# Altium project uz_per_current_measurement_hc5fw.PrjPcb
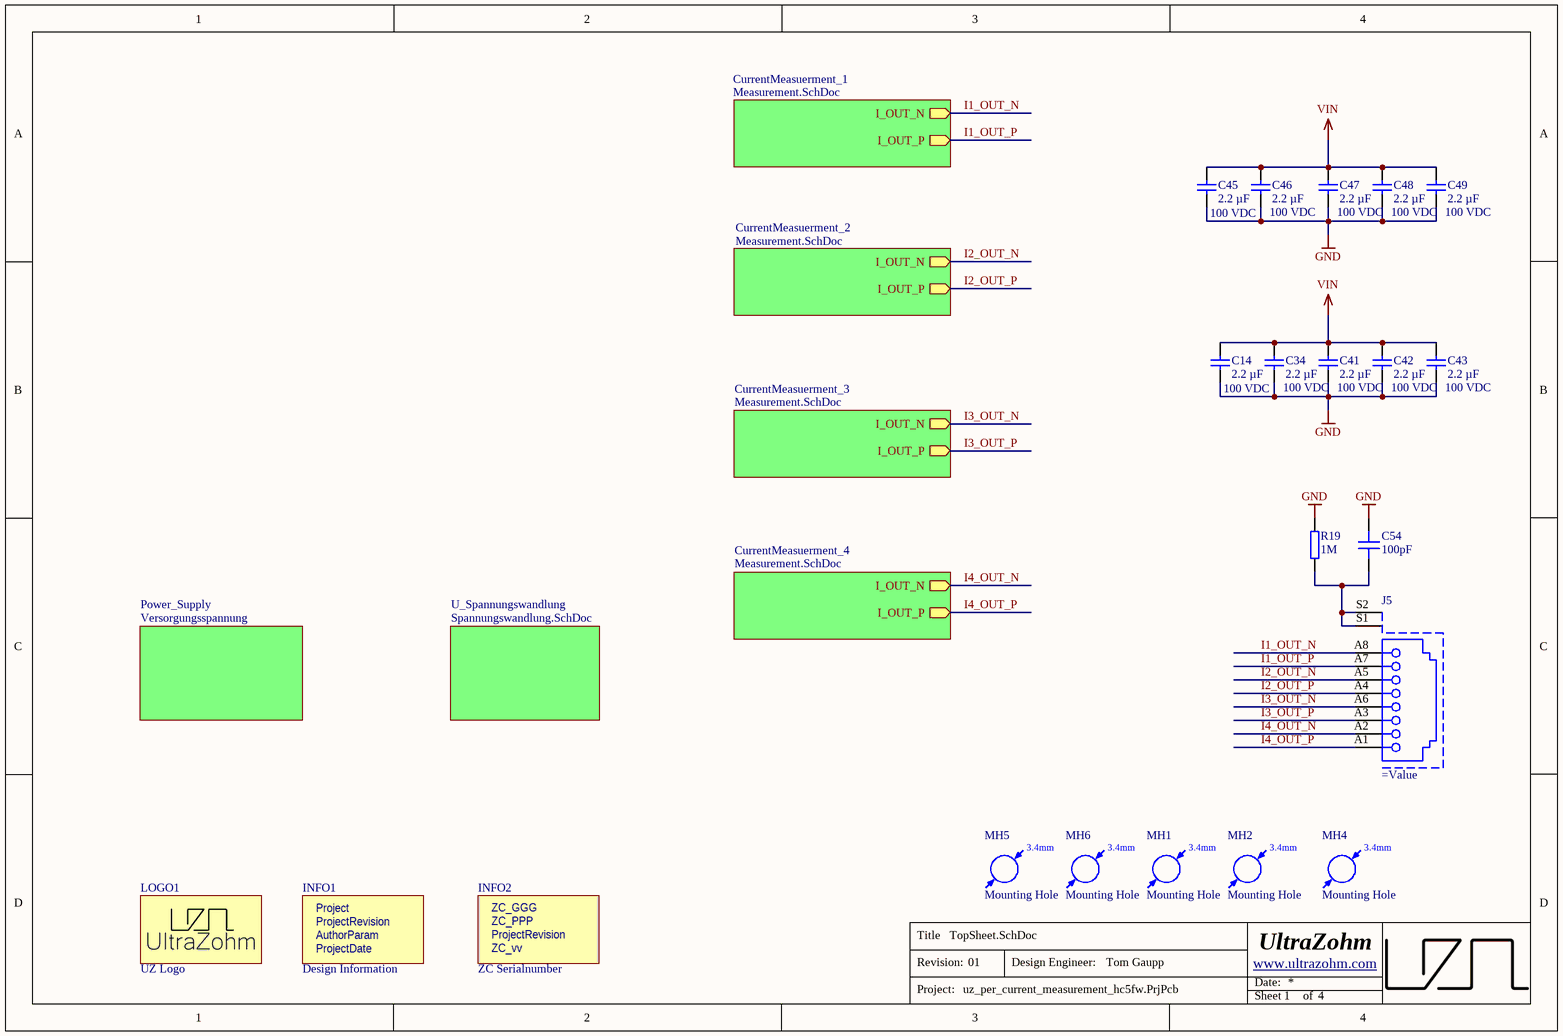
[diagram p0: TopSheet.SchDoc]
AuthorParam: Tom Gaupp; Project: uz_per_current_measurement_hc5fw; ProjectDate: 08/26; ProjectRevision: 01; ZC_GGG: 004; ZC_PPP: 008; ZC_vv: 0400
4 sheets, 210 parts. Net scope: hierarchical (ports join the sheet entries above them; power ports are global).
Board file: Strommessplatine.PcbDoc
Sheets:
  TopSheet.SchDoc
    CurrentMeasuerment_1 = Measurement.SchDoc
    CurrentMeasuerment_2 = Measurement.SchDoc
    U_Spannungswandlung = Spannungswandlung.SchDoc
    CurrentMeasuerment_3 = Measurement.SchDoc
    CurrentMeasuerment_4 = Measurement.SchDoc
    Power_Supply = Versorgungsspannung.SchDoc

## Sheet TopSheet.SchDoc
size A4; Author: Tom Gaupp; CompanyName: Technische Hochschule Nürnberg Georg Simon Ohm; Organization: UltraZohm; Address1: Kesslerplatz 12; Address2: 90489 Nürnberg; Address3: GERMANY; DocumentNumber: 2; SheetNumber: 1; SheetTotal: 4; Website: www.ultrazohm.com

### Parts
C14  2.2 µF  Voltage Rating: 100 VDC  [C_1210_TE]
C34  2.2 µF  Voltage Rating: 100 VDC  [C_1210_TE]
C41  2.2 µF  Voltage Rating: 100 VDC  [C_1210_TE]
C42  2.2 µF  Voltage Rating: 100 VDC  [C_1210_TE]
C43  2.2 µF  Voltage Rating: 100 VDC  [C_1210_TE]
C45  2.2 µF  Voltage Rating: 100 VDC  [C_1210_TE]
C46  2.2 µF  Voltage Rating: 100 VDC  [C_1210_TE]
C47  2.2 µF  Voltage Rating: 100 VDC  [C_1210_TE]
C48  2.2 µF  Voltage Rating: 100 VDC  [C_1210_TE]
C49  2.2 µF  Voltage Rating: 100 VDC  [C_1210_TE]
C54  100pF  [C_1206_TE]
INFO1  Design Information  [Design_info]  (no BOM)
INFO2  ZC Serialnumber  [ZC-Serial]  (no BOM)
J5  (no value)  [R-RJ45R10P-B000]
LOGO1  UZ Logo  [UZ_Logo_small]  (no BOM)
MH1  Mounting Hole  [MH_3.4]  (no BOM)
MH2  Mounting Hole  [MH_3.4]  (no BOM)
MH4  Mounting Hole  [MH_3.4]  (no BOM)
MH5  Mounting Hole  [MH_3.4]  (no BOM)
MH6  Mounting Hole  [MH_3.4]  (no BOM)
R19  1M  [RES 0603_1608]

### Sub-sheets
CurrentMeasuerment_1 = Measurement.SchDoc: I_OUT_P (out), I_OUT_N (out)
CurrentMeasuerment_2 = Measurement.SchDoc: I_OUT_P (out), I_OUT_N (out)
CurrentMeasuerment_3 = Measurement.SchDoc: I_OUT_P (out), I_OUT_N (out)
CurrentMeasuerment_4 = Measurement.SchDoc: I_OUT_P (out), I_OUT_N (out)
Power_Supply = Versorgungsspannung: no entries
U_Spannungswandlung = Spannungswandlung.SchDoc: no entries

### Nets
GND: C14.2 C34.2 C41.2 C42.2 C43.2 C45.2 C46.2 C47.2 C48.2 C49.2 C54.2 R19.2
VIN: C14.1 C34.1 C41.1 C42.1 C43.1 C45.1 C46.1 C47.1 C48.1 C49.1
I1_OUT_N: J5.A8 ; sheet CurrentMeasuerment_1/I_OUT_N
I1_OUT_P: J5.A7 ; sheet CurrentMeasuerment_1/I_OUT_P
I2_OUT_N: J5.A5 ; sheet CurrentMeasuerment_2/I_OUT_N
I2_OUT_P: J5.A4 ; sheet CurrentMeasuerment_2/I_OUT_P
I3_OUT_N: J5.A6 ; sheet CurrentMeasuerment_3/I_OUT_N
I3_OUT_P: J5.A3 ; sheet CurrentMeasuerment_3/I_OUT_P
I4_OUT_N: J5.A2 ; sheet CurrentMeasuerment_4/I_OUT_N
I4_OUT_P: J5.A1 ; sheet CurrentMeasuerment_4/I_OUT_P
NetC54_1: C54.1 J5.S1 J5.S2 R19.1

### Notes on the sheet
- Title
- Revision:
- Design Engineer:
- Date:
- Project:
- Sheet
- of
- (in symbol Design Information) Project; ProjectRevision; AuthorParam; ProjectDate
- (in symbol Mounting Hole) 3.4mm
- (in symbol ZC-Serial) ZC_GGG; ZC_PPP; ProjectRevision; ZC_vv

### Library data of the parts
C14 C34 C41-C43 C45-C49 = FS32X225K101EGG: 100V 2.2uF X7R ±10% 1210 Multilayer Ceramic Capacitors MLCC - SMD/SMT ROHS; Manufacturer: PSA(Prosperity Dielectrics); Created from: AGeiger; Manufacturer Part Number: FS32X225K101EGG; PartID: 170; Created On: 11.03.2025 16:22:30; ComponentLink1Description: Datasheet; ComponentLink1URL: https://www.lcsc.com/datasheet/lcsc_datasheet_2410121308_PSA-Prosperity-Dielectrics-FS32X225K101EGG_C153036.pdf; Component Type: Capacitor 1210; Device Package: 1210; Last Updated: 27.05.2025 19:11:48; Mounting Type: SMD; Operating Temperature: -55 to +125°C; Series: FS; Supplier 1: LCSC; Supplier Part Number 1: C153036; Type: Capacitor; Tolerance: 10%; Value: 2.2 µF; Live Cycle Status: 1; LCSC Part Number: C153036
C54 = 1206CG101J102NT: 100pF 1kV C0G ±5% 1206 Multilayer Ceramic Capacitors MLCC - SMD/SMT ROHS; Manufacturer: FH (Guangdong Fenghua Advanced Tech); Created from: TGaupp; Manufacturer Part Number: 1206CG101J102NT; PartID: 514; Created On: 07/10/2026 14:40:40; ComponentLink1Description: Datasheet; ComponentLink1URL: https://jlcpcb.com/partdetail/9713-1206CG101J102NT/C9188; Component Type: Capacitor 1206; Device Package: 1206; Last Updated: 07/10/2026 14:40:40; Mounting Type: SMD; Operating Temperature: -55 to +125°C; Series: C0G; Supplier 1: JLCPCB; Supplier Part Number 1: C9188; Type: Capacitor; Tolerance: 5 %; Voltage Rating: 1kV; Value: 100pF; Live Cycle Status: 1; LCSC Part Number: C9188; Stock number: not stored
INFO1 = Design Information: Manufacturer: UltraZohm; Created from: MGremer; Manufacturer Part Number: Design Information; PartID: 12; Created On: 03/11/2021 09:04:23; ComponentLink1Description: https://docs.ultrazohm.com/; ComponentLink1URL: homepage; Component Type: Design Information; Last Updated: 15/04/2025 09:29:36; Supplier 1: -; Supplier Part Number 1: -; Type: Design Information; Value: Design Information; Live Cycle Status: 1
INFO2 = ZC-Serial: Manufacturer: UltraZohm; Value: GGG-PPP-VVvv; Created from: FRosner; Manufacturer Part Number: ZC-Serial; PartID: 58; Created On: 15/04/2025 09:17:14; ComponentLink1Description: https://docs.ultrazohm.com/; ComponentLink1URL: homepage; Component Type: ZC Serialnumber; Last Updated: 15/04/2025 09:17:14; Supplier 1: -; Supplier Part Number 1: -; Type: Serial Number; Live Cycle Status: 1
J5 = R-RJ45R10P-B000: RJ45Receptacle 1 Shielded Bend insert Without LED 0℃~+70℃ Plugin Ethernet Connectors / Modular Connectors (RJ45 RJ11) ROHS; Manufacturer: Ckmtw(Shenzhen Cankemeng); Created from: KIlhan; Manufacturer Part Number: R-RJ45R10P-B000; PartID: 57; Created On: 20/03/2025 09:19:07; ComponentLink1Description: Datasheet; ComponentLink1URL: https://jlcpcb.com/api/file/downloadByFileSystemAccessId/8588892085580021760; Last Updated: 20/03/2025 13:46:21; Mounting Type: THT; Operating Temperature: 0℃~+70℃; Series: RJ45; Supplier 1: LCSC; Supplier Part Number 1: C386758; Value: R-RJ45R10P-B000; LCSC Part Number: C386758
LOGO1 = Logo small: Manufacturer: UltraZohm; Created from: MGremer; Created: Jan2021_Liegmann; Value: Logo; Manufacturer Part Number: Logo small; PartID: 10; Created On: 03.11.2021 09:04:23; ComponentLink1Description: https://docs.ultrazohm.com/; ComponentLink1URL: homepage; Component Type: Logo; Last Updated: 03.11.2021 09:05:50; Supplier 1: -; Supplier Part Number 1: -; Type: Logo; Live Cycle Status: 1
MH1 MH2 MH4-MH6 = Mounting Hole: Created from: MHlatky; Manufacturer Part Number: Mounting Hole; PartID: 16; Created On: 26.01.2021 09:19:51; ComponentLink1Description: Datasheet; Component Type: Mounting Hole; Device Package: -; Last Updated: 21.03.2022 23:05:12; Manufacturer: Mounting Hole; Supplier 1: Mounting Hole; Supplier Part Number 1: Mounting Hole; Type: Mounting Hole; Value: Mounting Hole; Live Cycle Status: 1; Stock number: not stored
R19 = CRCW06031M00FKEAC: SMD resistor 1%; Manufacturer: Vishay / Dale; Created from: MGremer; Manufacturer Part Number: CRCW06031M00FKEAC; PartID: 179; Created On: 14/12/2020 16:17:14; ComponentLink1Description: Datasheet; ComponentLink1URL: https://www.mouser.de/datasheet/2/427/crcwce3-1762584.pdf; Component Type: SMD resistor; Device Package: 0603; Last Updated: 07/10/2026 14:27:53; Mounting Type: SMD; Supplier 1: Mouser; Supplier Part Number 1: 71-CRCW06031M00FKEAC; Type: Resistor; Tolerance: 1%; Value: 1M; Live Cycle Status: 1; Stock number: not stored; LCSC Part Number: C844537

## Sheet Measurement.SchDoc
size A4; Author: Tom Gaupp; CompanyName: Technische Hochschule Nürnberg Georg Simon Ohm; Organization: UltraZohm; Address1: Kesslerplatz 12; Address2: 90489 Nürnberg; Address3: GERMANY; DocumentNumber: 3; SheetNumber: 3; SheetTotal: 4; Website: www.ultrazohm.com
Used 4 times, as channels CurrentMeasuerment_1, CurrentMeasuerment_2, CurrentMeasuerment_3, CurrentMeasuerment_4. Parts and nets are listed once, with the designators drawn on the sheet.
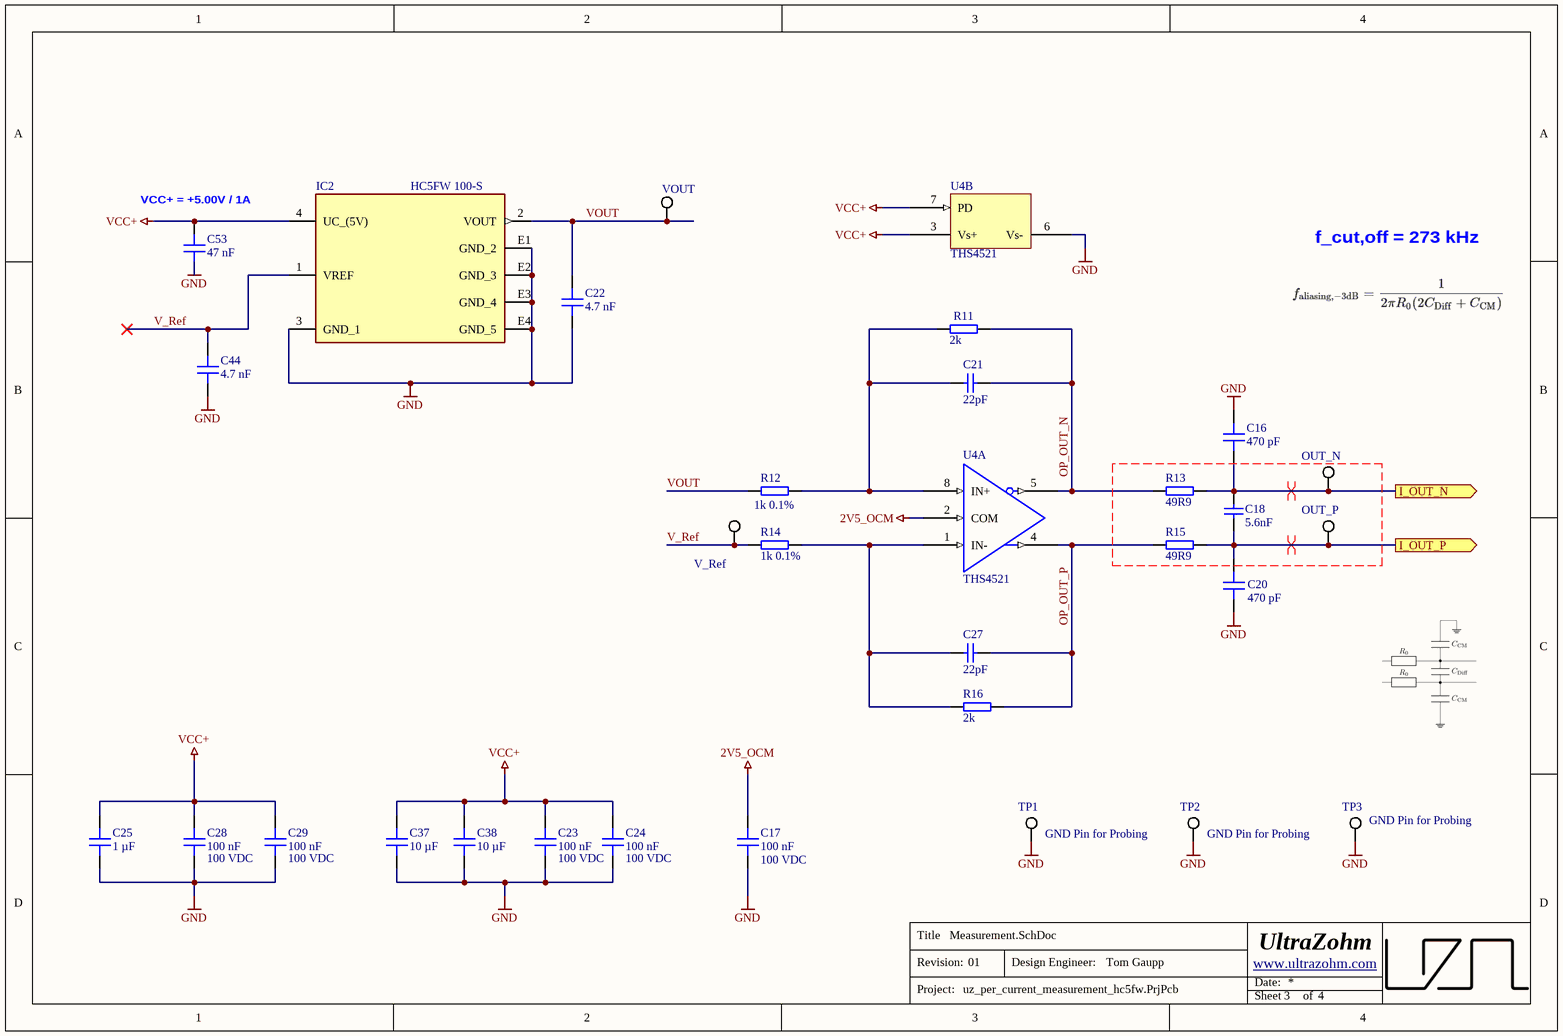
[diagram p1: Measurement.SchDoc]

### Parts
C16  470 pF  [C_0603]
C17  100 nF  Voltage Rating: 100 VDC  [C_0603]
C18  5.6nF  [C_0603_TE]
C20  470 pF  [C_0603]
C21  22pF  [C_0603_TE]
C22  4.7 nF  [C_0603]
C23  100 nF  Voltage Rating: 100 VDC  [C_0603]
C24  100 nF  Voltage Rating: 100 VDC  [C_0603]
C25  1 µF  [C_0603]
C27  22pF  [C_0603_TE]
C28  100 nF  Voltage Rating: 100 VDC  [C_0603]
C29  100 nF  Voltage Rating: 100 VDC  [C_0603]
C37  10 µF  [C0805]
C38  10 µF  [C0805]
C44  4.7 nF  [C_0603]
C53  47 nF  [C_0603]
IC2  HC5FW 100-S  [LEM_HC5FW]
OUT_N  5015  [KSTN-5019_V]  (value not drawn)
OUT_P  5015  [KSTN-5019_V]  (value not drawn)
R11  2k  [RES 0603_1608]
R12  1k 0.1%  [RES 0603_1608]
R13  49R9  [RES 0603_1608]
R14  1k 0.1%  [RES 0603_1608]
R15  49R9  [RES 0603_1608]
R16  2k  [RES 0603_1608]
TP1  5015  [KSTN-5019_V]  (value not drawn)
TP2  5015  [KSTN-5019_V]  (value not drawn)
TP3  5015  [KSTN-5019_V]  (value not drawn)
U4  THS4521  [SOIC127P600X175-8N]  (parts A,B of 2)
V_Ref  5015  [KSTN-5019_V]  (value not drawn)
VOUT  5019  [KSTN-5019_V]  (value not drawn)

### Ports
I_OUT_N (out), I_OUT_P (out)

### Nets
2V5_OCM: C17.1 U4.2(COM)
GND: C16.1 C17.2 C20.2 C22.1 C23.1 C24.1 C25.1 C28.1 C29.1 C37.1 C38.1 C44.1 C53.1 IC2.3(GND_1) IC2.E1(GND_2) IC2.E2(GND_3) IC2.E3(GND_4) IC2.E4(GND_5) TP1.1 TP2.1 TP3.1 U4.6(Vs-)
VCC+: C23.2 C24.2 C25.2 C28.2 C29.2 C37.2 C38.2 C53.2 IC2.4(UC_(5V)) U4.3(Vs+) U4.7(PD)
I_OUT_N: C16.2 C18.1 OUT_N.1 R13.2 ; port I_OUT_N
I_OUT_P: C18.2 C20.1 OUT_P.1 R15.2 ; port I_OUT_P
OP_OUT_N: C21.1 R11.2 R13.1 U4.5(OUT-)
OP_OUT_P: C27.1 R15.1 R16.2 U4.4(OUT+)
V_Ref: C44.2 IC2.1(VREF) R14.1 V_Ref.1
VOUT: C22.2 IC2.2(VOUT) R12.1 VOUT.1
NetC21_2: C21.2 R11.1 R12.2 U4.8(IN+)
NetC27_2: C27.2 R14.2 R16.1 U4.1(IN-)

### Channels
CurrentMeasuerment_1: designators end in A; ports I_OUT_N=I1_OUT_N I_OUT_P=I1_OUT_P
CurrentMeasuerment_2: designators end in B; ports I_OUT_N=I2_OUT_N I_OUT_P=I2_OUT_P
CurrentMeasuerment_3: designators end in C; ports I_OUT_N=I3_OUT_N I_OUT_P=I3_OUT_P
CurrentMeasuerment_4: designators end in D; ports I_OUT_N=I4_OUT_N I_OUT_P=I4_OUT_P

### Layout directives
differential pair: I1_OUT_N, I1_OUT_P

### Notes on the sheet
- (near C53) VCC+ = +5.00V / 1A
- f_cut,off = 273 kHz
- (near TP1) GND Pin for Probing
- (near TP2) GND Pin for Probing
- (near TP3) GND Pin for Probing
- Title
- Revision:
- Design Engineer:
- Date:
- Project:
- Sheet
- of

### Library data of the parts
C16 C20 = C0603C471K5RACAUTO: 50V 470pF X7R ±10% 0603 Multilayer Ceramic Capacitors MLCC - SMD/SMT ROHS; Manufacturer: KEMET; Voltage Rating: 50 VDC; Created from: KIlhan; Manufacturer Part Number: C0603C471K5RACAUTO; ComponentLink1Description: Datasheet; ComponentLink1URL: https://lcsc.com/datasheet/lcsc_datasheet_2410010302_KEMET-C0603C471K5RACAUTO_C129628.pdf; Series: SMD Comm X7R; Supplier 1: JLCPCB; Supplier Part Number 1: C129628; Tolerance: 10 %; PartID: 500; Created On: 07/07/2025 10:21:07; Component Type: Capacitor 0603; Device Package: 0603; Last Updated: 07/07/2025 10:21:07; Mounting Type: SMD; Operating Temperature: -55 - 125°C; Type: Capacitor; Value: 470 pF; Live Cycle Status: 1; Stock number: not stored; LCSC Part Number: C129628
C17 C23 C24 C28 C29 = C1608X7S2A104KT000N: 100V 100nF X7S ±10% 0603 Multilayer Ceramic Capacitors MLCC - SMD/SMT ROHS; Manufacturer: TDK; Created from: AGeiger; Manufacturer Part Number: C1608X7S2A104KT000N; PartID: 148; Created On: 20.12.2020 13:54:13; ComponentLink1Description: Datasheet; ComponentLink1URL: https://datasheet.lcsc.com/lcsc/2304140030_TDK-C1608X7S2A104KT000N_C343025.pdf; Component Type: Capacitor 0603; Device Package: 0603; Last Updated: 14.12.2022 12:14:21; Mounting Type: SMD; Operating Temperature: -55 to 125°C; Series: X7R; Supplier 1: LCSC; Supplier Part Number 1: C343025; Type: Capacitor; Tolerance: 10 %; Value: 100 nF; Live Cycle Status: 1; LCSC Part Number: C343025; Stock number: not stored
C18 = 0603B562K500NT: 50V 5.6nF X7R ±10% 0603 Multilayer Ceramic Capacitors MLCC - SMD/SMT ROHS; Manufacturer: FH (Guangdong Fenghua Advanced Tech); Created from: Kilhan; Manufacturer Part Number: 0603B562K500NT; ComponentLink1Description: Datasheet; ComponentLink1URL: https://jlcpcb.com/api/file/downloadByFileSystemAccessId/8588903217349971968; Series: X7R; Supplier 1: LCSC; Supplier Part Number 1: C1628; Tolerance: 10%; Voltage Rating: 50V; PartID: 171; Created On: 18/06/2025 16:23:16; Component Type: Capacitor 0603; Device Package: 0603; Last Updated: 18/06/2025 16:23:16; Mounting Type: SMD; Operating Temperature: –55 to 125°C; Type: Capacitor; Value: 5.6nF; Live Cycle Status: 1; Stock number: not stored; LCSC Part Number: C1628
C21 C27 = CL10C220JB8NNNC: 50V 22pF C0G ±5% 0603 Multilayer Ceramic Capacitors MLCC - SMD/SMT ROHS; Manufacturer: Samsung Electro-Mechanics; Created from: Kilhan; Manufacturer Part Number: CL10C220JB8NNNC; ComponentLink1Description: Datasheet; ComponentLink1URL: https://jlcpcb.com/api/file/downloadByFileSystemAccessId/8579707043277824000; Series: C0G; Supplier 1: LCSC; Supplier Part Number 1: C1653; Tolerance: 5%; Voltage Rating: 50V; PartID: 172; Created On: 22/06/2025 13:02:55; Component Type: Capacitor 0603; Device Package: 0603; Last Updated: 22/06/2025 13:02:55; Mounting Type: SMD; Operating Temperature: –55 to 125°C; Type: Capacitor; Value: 22pF; Live Cycle Status: 1; Stock number: not stored; LCSC Part Number: C1653
C22 C44 = C0603C472K4RECAUTO: Capacitor 0603, 16 VDC, 4.7 nF, X7R; Manufacturer: KEMET; Tolerance: 10 %; Voltage Rating: 16 VDC; Created from: MGremer; Manufacturer Part Number: C0603C472K4RECAUTO; PartID: 35; Created On: 20/12/2020 13:54:13; ComponentLink1Description: Datasheet; ComponentLink1URL: https://www.mouser.de/datasheet/2/212/1/KEM_C1090_X7R_ESD-1103328.pdf; Component Type: Capacitor 0603; Device Package: 0603; Last Updated: 05/08/2026 12:55:18; Mounting Type: SMD; Operating Temperature: -55 - 125°C; Series: ESD SMD Auto X7R; Supplier 1: Mouser; Supplier Part Number 1: 80-C0603C472K4RECAUT; Type: Capacitor; Value: 4.7 nF; Live Cycle Status: 1; LCSC Part Number: C2176713; Stock number: Labor SMD Container
C25 = CL10A105KB8NNNC: 50V 1uF X5R ±10% 0603  Multilayer Ceramic Capacitors MLCC - SMD/SMT ROHS; Manufacturer: Samsung Electro-Mechanics; Voltage Rating: 50 VDC; Created from: MGremer; Manufacturer Part Number: CL10A105KB8NNNC; PartID: 5; Created On: 20/12/2020 13:54:13; ComponentLink1Description: Datasheet; ComponentLink1URL: https://datasheet.lcsc.com/lcsc/1810261812_Samsung-Electro-Mechanics-CL10A105KB8NNNC_C15849.pdf; Component Type: Capacitor 0603; Device Package: 0603; Last Updated: 28/11/2022 17:23:01; Mounting Type: SMD; Operating Temperature: -55 - 85°C; Series: M; Supplier 1: LCSC; Supplier Part Number 1: C15849; Type: Capacitor; Tolerance: 10 %; Value: 1 µF; Live Cycle Status: 1; Stock number: Labor SMD Container; LCSC Part Number: C15849
C37 C38 = GRM21BR6YA106KE43L: Capacitor 0805, 35 VDC, 10 µF, X5R; Manufacturer: muRata; Tolerance: 10 %; Voltage Rating: 35 VDC; Created from: MGremer; Manufacturer Part Number: GRM21BR6YA106KE43L; PartID: 28; Created On: 20.12.2020 13:54:13; ComponentLink1Description: Datasheet; ComponentLink1URL: https://www.mouser.de/datasheet/2/281/murata_03052018_GRM_Series_1-1310166.pdf; Component Type: Capacitor 0805; Device Package: 0805; Last Updated: 20.12.2020 17:44:37; Mounting Type: SMD; Operating Temperature: -55 - 85°C; Series: GRM; Supplier 1: Mouser; Supplier Part Number 1: 81-GRM21BR6YA106KE3L; Type: Capacitor; Value: 10 µF; Live Cycle Status: 1; Stock number: Labor SMD Container; LCSC Part Number: C162422
C53 = CL10B473KB8NNNC: Capacitor 0603, 50 VDC, 47 nF, X7R; Manufacturer: Samsung Electro-Mechanics; Tolerance: 10 %; Voltage Rating: 50 VDC; Created from: DHufnagel; Manufacturer Part Number: CL10B473KB8NNNC; PartID: 97; Created On: 20/07/2022 09:55:05; ComponentLink1Description: Datasheet; ComponentLink1URL: https://www.mouser.de/datasheet/2/585/MLCC-1837944.pdf; Component Type: Capacitor 0603; Device Package: 0603; Last Updated: 20/07/2022 09:55:05; Mounting Type: SMD; Operating Temperature: -55 - 125°C; Series: X7R; Supplier 1: Mouser; Supplier Part Number 1: 187-CL10B473KB8NNNC; Supplier 2: LCSC; Supplier Part Number 2: C1622; Type: Capacitor; Value: 47 nF; Live Cycle Status: 1; LCSC Part Number: C1622; Stock number: not stored
IC2 = HC5FW 100-S: -100 A - 100 A, 40 kHz; Manufacturer: LEM; Value: 100A; Created from: TGaupp; Datasheet Link: https://www.lem.com/sites/default/files/products_datasheets/cksr_series.pdf; Height: 16mm; Manufacturer Part Number: HC5FW 100-S; Supplier Part Number 1: 61-HC5FW100-S; Mounting Technology: THT; Supplier 1: Mouser; PartID: 7; Created On: 01/07/2026 10:26:16; ComponentLink1Description: Datasheet; ComponentLink1URL: https://www.lem.com/sites/default/files/products_datasheets/hc5fw_100-s.pdf; Component Type: Hall-Current Sensor; Device Package: THT; Last Updated: 01/07/2026 10:26:16; Mounting Type: THT; Operating Temperature: -40 - 125°C; Series: HC5 Series; Type: Current Sensor; Live Cycle Status: 1; Stock number: not stocked
OUT_N OUT_P TP1-TP3 V_Ref = 5015: Circuit Board Hardware - PCB SM TEST POINT ON T&R - MINIATURE; Manufacturer: Keystone Electronics; Value: SMD Testpoint; Created from: AGeiger; Supplier Part Number 1: 534-5015; LCSC Part Number: C5199798; Manufacturer Part Number: 5015; PartID: 26; Created On: 03/06/2023 11:19:55; ComponentLink1Description: Datasheet; ComponentLink1URL: https://www.mouser.de/datasheet/2/215/015-744075.pdf; Component Type: Circuit Board Hardware; Device Package: SMD; Last Updated: 03/06/2023 11:43:17; Mounting Type: SMD; Supplier 1: Mouser; Type: PCB SMD Testpoint; Live Cycle Status: 1; ComponentLink2URL: http://www.keyelco.com/product-pdf.cfm?p=1357; ComponentLink2Description: Datasheet
R11 R16 = ERJ-PB3B2001V: SMD resistor 0.1%; Manufacturer: Panasonic; Created from: DHufnagel; Manufacturer Part Number: ERJ-PB3B2001V; PartID: 215; Created On: 14/12/2020 16:17:14; ComponentLink1Description: Datasheet; ComponentLink1URL: https://www.mouser.de/datasheet/2/315/AOA0000C328-1530132.pdf; Component Type: SMD resistor; Device Package: 0603; Last Updated: 02/03/2021 14:07:32; Mounting Type: SMD; Supplier 1: Mouser; Supplier Part Number 1: 667-ERJ-PB3B2001V; Type: Resistor; Value: 2k; Live Cycle Status: 1; Stock number: not stored; LCSC Part Number: C189729; Tolerance: 0.1%; Supplier 2: LCSC; Supplier Part Number 2: C189729
R12 R14 = AR03BTCX1001: 100mW ±0.1% ±25ppm/℃ 1kΩ 0603 Chip Resistor - Surface Mount ROHS; Manufacturer: Viking Tech; Created from: AGeiger; Manufacturer Part Number: AR03BTCX1001; PartID: 240; Created On: 03/09/2022 10:12:43; ComponentLink1Description: Datasheet; ComponentLink1URL: https://datasheet.lcsc.com/lcsc/2011191435_Viking-Tech-AR03BTCX1001_C304069.pdf; Component Type: SMD resistor; Device Package: 0603; Last Updated: 03/09/2022 10:12:43; Mounting Type: SMD; Supplier 1: LCSC; Supplier Part Number 1: C304069; Type: Resistor; Value: 1k; Live Cycle Status: 1; LCSC Part Number: C304069; Tolerance: 0.1%
R13 R15 = RC0603FR-0749R9L: 100mW Thick Film Resistors ±100ppm/℃ ±1% 49.9Ω 0603 Chip Resistor - Surface Mount ROHS; Manufacturer: YAGEO; Created from: AGeiger; Manufacturer Part Number: RC0603FR-0749R9L; PartID: 277; Created On: 14/06/2023 17:42:26; ComponentLink1Description: Datasheet; ComponentLink1URL: https://datasheet.lcsc.com/lcsc/2304140030_YAGEO-RC0603FR-0749R9L_C114625.pdf; Component Type: SMD resistor; Device Package: 0603; Last Updated: 14/06/2023 17:42:26; Mounting Type: SMD; Supplier 1: LCSC; Supplier Part Number 1: C114625; Type: Resistor; Tolerance: 1%; Value: 49R9; Live Cycle Status: 1; LCSC Part Number: C114625
U4 = THS4521IDR: THS452x Very Low Power, Negative Rail Input, Rail-To-Rail Output, Fully Differential Amplifier; Manufacturer: Texas Instruments; Channels: 1; GBP: 145 MHz; Created from: AGeiger; Manufacturer Part Number: THS4521IDR; PartID: 15; Created On: 03/09/2022 09:19:34; ComponentLink1Description: Datasheet; ComponentLink1URL: https://www.ti.com/cn/lit/ds/symlink/ths4521.pdf?ts=1662191143470; Component Type: Differential Amplifier; Device Package: SOIC-8; Last Updated: 30/09/2024 15:54:43; Mounting Type: SMD; Operating Temperature: -40 to +85 °C; Series: THS4521; Supplier 1: LCSC; Supplier Part Number 1: C16092; Type: Differential Amplifiers; Value: THS4521; Live Cycle Status: 1; LCSC Part Number: C16092
VOUT = 5019: Circuit Board Hardware - PCB SM TEST POINT ON T&R - MINIATURE; Manufacturer: Keystone Electronics; Value: SMD Testpoint; Created from: AGeiger; ComponentLink1Description: Datasheet; ComponentLink2URL: http://www.keyelco.com/product-pdf.cfm?p=1357; ComponentLink1URL: https://www.mouser.de/datasheet/2/215/019-743690.pdf; ComponentLink2Description: Datasheet; Manufacturer Part Number: 5019; PartID: 27; Created On: 03/06/2023 11:34:10; Component Type: Circuit Board Hardware; Device Package: SMD; Last Updated: 03/06/2023 11:43:17; Mounting Type: SMD; Supplier 1: Mouser; Supplier Part Number 1: 534-5019; Type: PCB SMD Testpoint; Live Cycle Status: 1; LCSC Part Number: C5199800

## Sheet Spannungswandlung.SchDoc
size A4; Author: Tom Gaupp; CompanyName: Technische Hochschule Nürnberg Georg Simon Ohm; Organization: UltraZohm; Address1: Kesslerplatz 12; Address2: 90489 Nürnberg; Address3: GERMANY; DocumentNumber: 1; SheetNumber: 2; SheetTotal: 4; Website: www.ultrazohm.com
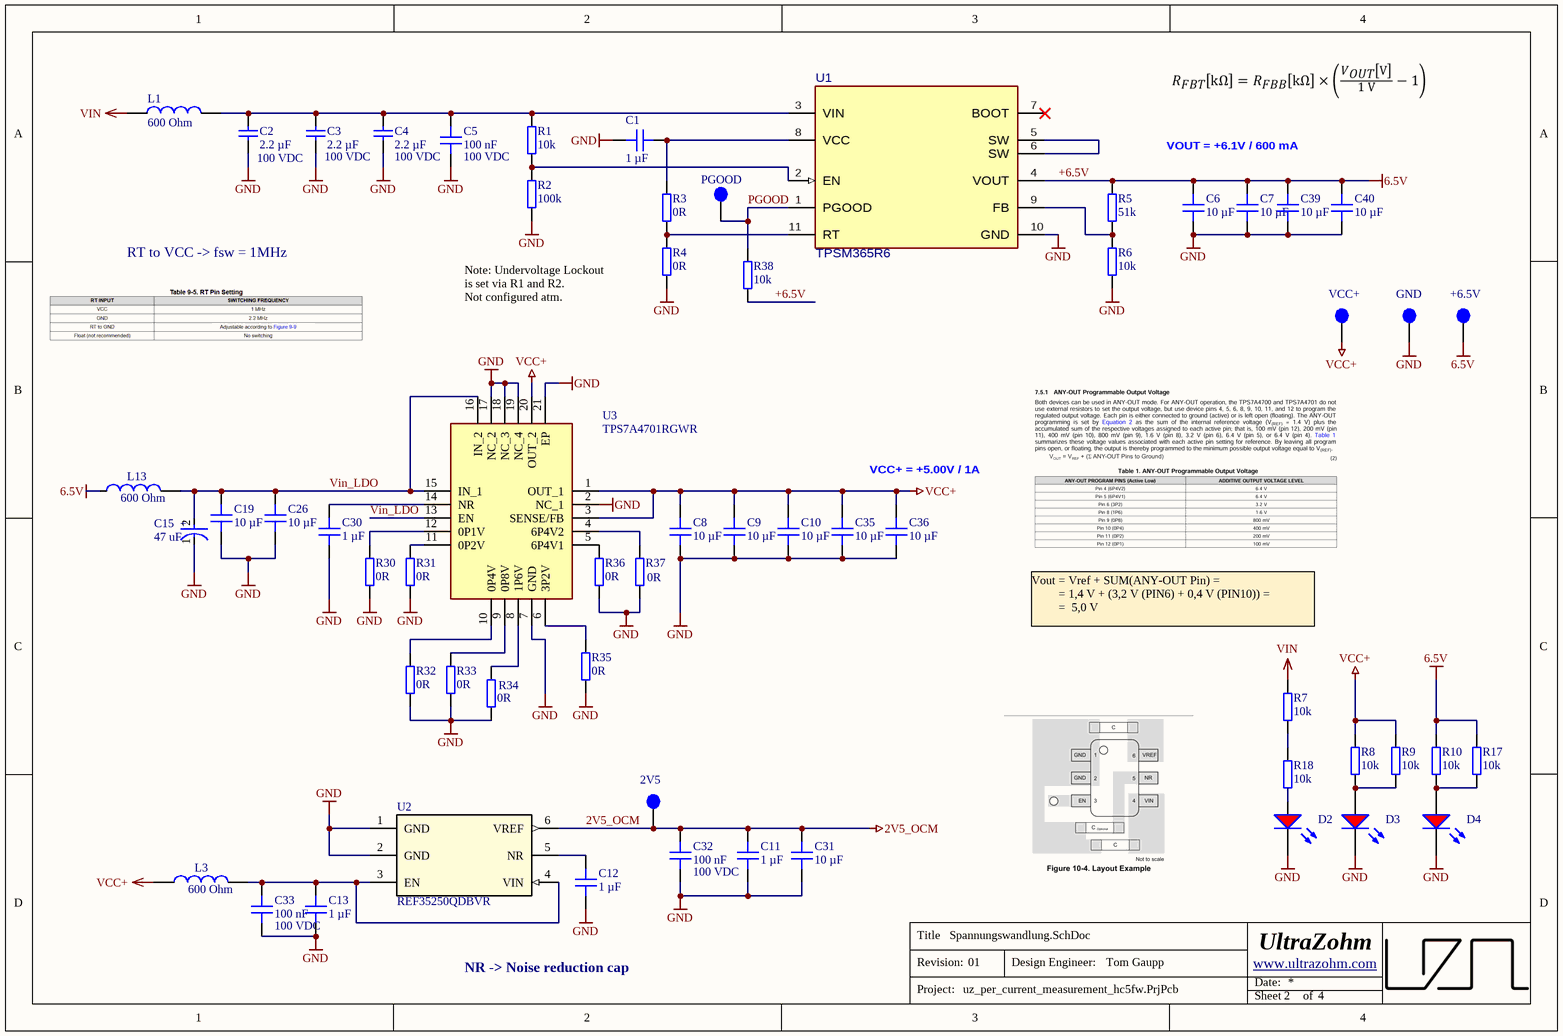
[diagram p2: Spannungswandlung.SchDoc]

### Parts
2V5  2V5  [TP_1mm]  (value not drawn)  (no BOM)
+6.5V  6.5 V  [TP_1mm]  (value not drawn)  (no BOM)
C1  1 µF  [C_0603]
C2  2.2 µF  Voltage Rating: 100 VDC  [C_1210_TE]
C3  2.2 µF  Voltage Rating: 100 VDC  [C_1210_TE]
C4  2.2 µF  Voltage Rating: 100 VDC  [C_1210_TE]
C5  100 nF  Voltage Rating: 100 VDC  [C_0603]
C6  10 µF  [C0805]
C7  10 µF  [C0805]
C8  10 µF  [C0805]
C9  10 µF  [C0805]
C10  10 µF  [C0805]
C11  1 µF  [C_0603]
C12  1 µF  [C_0603]
C13  1 µF  [C_0603]
C15  47 uF  [10TPE47MAZB]
C19  10 µF  [C0805]
C26  10 µF  [C0805]
C30  1 µF  [C_0603]
C31  10 µF  [C0805]
C32  100 nF  Voltage Rating: 100 VDC  [C_0603]
C33  100 nF  Voltage Rating: 100 VDC  [C_0603]
C35  10 µF  [C0805]
C36  10 µF  [C0805]
C39  10 µF  [C0805]
C40  10 µF  [C0805]
D2  KT-0603R  [WL-SMCW_0603]  (value not drawn)
D3  KT-0603R  [WL-SMCW_0603]  (value not drawn)
D4  KT-0603R  [WL-SMCW_0603]  (value not drawn)
GND  Testpoint 1mm  [TP_1mm]  (value not drawn)  (no BOM)
L1  600 Ohm  [WE-CBF_0805_High Current]
L3  600 Ohm  [WE-CBF_0805_High Current]
L13  600 Ohm  [WE-CBF_0805_High Current]
PGOOD  Testpoint 1mm  [TP_1mm]  (value not drawn)  (no BOM)
R1  10k  [RES 0603_1608]
R2  100k  [RES 0603_1608]
R3  0R  [RES 0603_1608]
R4  0R  [RES 0603_1608]
R5  51k  [R_0603_TE]
R6  10k  [RES 0603_1608]
R7  10k  [RES 0603_1608]
R8  10k  [RES 0603_1608]
R9  10k  [RES 0603_1608]
R10  10k  [RES 0603_1608]
R17  10k  [RES 0603_1608]
R18  10k  [RES 0603_1608]
R30  0R  [RES 0603_1608]
R31  0R  [RES 0603_1608]
R32  0R  [RES 0603_1608]
R33  0R  [RES 0603_1608]
R34  0R  [RES 0603_1608]
R35  0R  [RES 0603_1608]
R36  0R  [RES 0603_1608]
R37  0R  [RES 0603_1608]
R38  10k  [RES 0603_1608]
U1  TPSM365R6  [RDN0011A-MFG]
U2  REF35250QDBVR  [TI_SOT23_6-Leads]
U3  TPS7A4701RGWR  [QFN65P500X500X100-21N-D]
VCC+  VCC+  [TP_1mm]  (value not drawn)  (no BOM)

### Nets
2V5_OCM: 2V5.1 C11.2 C31.2 C32.2 U2.6(VREF)
+6.5V: +6.5V.1 C6.2 C7.2 C39.2 C40.2 L13.1 R5.2 R10.1 R17.1 R38.2 U1.4(VOUT)  [also labelled 6.5V]
GND: C1.2 C2.2 C3.2 C4.2 C5.1 C6.1 C7.1 C8.1 C9.1 C10.1 C11.1 C12.1 C13.1 C15.1(C) C19.1 C26.1 C30.2 C31.1 C32.1 C33.1 C35.1 C36.1 C39.1 C40.1 D2.1(K) D3.1(K) D4.1(K) GND.1 R2.2 R4.1 R6.2 R30.2 R31.1 R32.1 R33.1 R34.1 R35.2 R36.1 R37.1 U1.10(GND) U2.1(GND) U2.2(GND) U3.2(NC_1) U3.7(GND) U3.17(NC_2) U3.18(NC_3) U3.19(NC_4) U3.21(EP)
VCC+: C8.2 C9.2 C10.2 C35.2 C36.2 L3.1 R8.1 R9.1 U3.1(OUT_1) U3.3(SENSE/FB) U3.20(OUT_2) VCC+.1
VIN: L1.1 R7.1
PGOOD: PGOOD.1 R38.1 U1.1(PGOOD)
Vin_LDO: C15.2(A) C19.2 C26.2 L13.2 U3.13(EN) U3.15(IN_1) U3.16(IN_2)
NetC1_1: C1.1 R3.2 U1.8(VCC)
NetC2_1: C2.1 C3.1 C4.1 C5.2 L1.2 R1.2 U1.3(VIN)
NetC12_2: C12.2 U2.5(NR)
NetC13_2: C13.2 C33.2 L3.2 U2.3(EN) U2.4(VIN)
NetC30_1: C30.1 U3.14(NR)
NetD2_2: D2.2(A) R18.2
NetD3_2: D3.2(A) R8.2 R9.2
NetD4_2: D4.2(A) R10.2 R17.2
NetR1_1: R1.1 R2.1 U1.2(EN)
NetR3_1: R3.1 R4.2 U1.11(RT)
NetR5_1: R5.1 R6.1 U1.9(FB)
NetR7_2: R7.2 R18.1
NetR30_1: R30.1 U3.12(0P1V)
NetR31_2: R31.2 U3.11(0P2V)
NetR32_2: R32.2 U3.10(0P4V)
NetR33_2: R33.2 U3.9(0P8V)
NetR34_2: R34.2 U3.8(1P6V)
NetR35_1: R35.1 U3.6(3P2V)
NetR36_2: R36.2 U3.5(6P4V1)
NetR37_2: R37.2 U3.4(6P4V2)
NetU1_5: U1.5(SW) U1.6(SW)

Not connected (* = marked no-connect by the designer): U1 7(BOOT)*

### Notes on the sheet
- VOUT = +6.1V / 600 mA
- RT to VCC -> fsw = 1MHz
- Note: Undervoltage Lockout is set via R1 and R2.
  Not configured atm.
- VCC+ = +5.00V / 1A
- Vout = Vref + SUM(ANY-OUT Pin) =
  = 1,4 V + (3,2 V (PIN6) + 0,4 V (PIN10)) =
  =  5,0 V
- NR -> Noise reduction cap
- Title
- Revision:
- Design Engineer:
- Date:
- Project:
- Sheet
- of
- (in symbol 10TPE47MAZB) +

### Library data of the parts
2V5 +6.5V VCC+ = NULL: Testpoint 1mm; Manufacturer Part Number: NULL; Created from: AGeiger; Created: 2018_06_25_AGeiger; Value: Testpoint 1mm; PartID: 9; Created On: 20/09/2022 13:14:57; Component Type: Testpoint; Last Updated: 20/09/2022 13:15:39; Manufacturer: NULL; Supplier 1: NULL; Supplier Part Number 1: NULL; Type: Testpoint; Live Cycle Status: 1
C1 C11-C13 C30 = CL10A105KB8NNNC: as C25 on sheet Measurement; Manufacturer Part Number: CL10A105KB8NNNC; PartID: 5; Created On: 20/12/2020 13:54:13; ComponentLink1Description: Datasheet; ComponentLink1URL: https://datasheet.lcsc.com/lcsc/1810261812_Samsung-Electro-Mechanics-CL10A105KB8NNNC_C15849.pdf; Component Type: Capacitor 0603; Device Package: 0603; Last Updated: 28/11/2022 17:23:01; Mounting Type: SMD; Operating Temperature: -55 - 85°C; Series: M; Supplier 1: LCSC; Supplier Part Number 1: C15849; Type: Capacitor; Tolerance: 10 %; Value: 1 µF; Live Cycle Status: 1; Stock number: Labor SMD Container; LCSC Part Number: C15849
C2-C4 = FS32X225K101EGG: as C14 on sheet TopSheet; Manufacturer Part Number: FS32X225K101EGG; PartID: 170; Created On: 11.03.2025 16:22:30; ComponentLink1Description: Datasheet; ComponentLink1URL: https://www.lcsc.com/datasheet/lcsc_datasheet_2410121308_PSA-Prosperity-Dielectrics-FS32X225K101EGG_C153036.pdf; Component Type: Capacitor 1210; Device Package: 1210; Last Updated: 27.05.2025 19:11:48; Mounting Type: SMD; Operating Temperature: -55 to +125°C; Series: FS; Supplier 1: LCSC; Supplier Part Number 1: C153036; Type: Capacitor; Tolerance: 10%; Value: 2.2 µF; Live Cycle Status: 1; LCSC Part Number: C153036
C5 C32 C33 = C1608X7S2A104KT000N: as C17 on sheet Measurement; Manufacturer Part Number: C1608X7S2A104KT000N; PartID: 148; Created On: 20.12.2020 13:54:13; ComponentLink1Description: Datasheet; ComponentLink1URL: https://datasheet.lcsc.com/lcsc/2304140030_TDK-C1608X7S2A104KT000N_C343025.pdf; Component Type: Capacitor 0603; Device Package: 0603; Last Updated: 14.12.2022 12:14:21; Mounting Type: SMD; Operating Temperature: -55 to 125°C; Series: X7R; Supplier 1: LCSC; Supplier Part Number 1: C343025; Type: Capacitor; Tolerance: 10 %; Value: 100 nF; Live Cycle Status: 1; LCSC Part Number: C343025; Stock number: not stored
C6-C10 C19 C26 C31 C35 C36 C39 C40 = GRM21BR6YA106KE43L: as C37 on sheet Measurement; Manufacturer Part Number: GRM21BR6YA106KE43L; PartID: 28; Created On: 20.12.2020 13:54:13; ComponentLink1Description: Datasheet; ComponentLink1URL: https://www.mouser.de/datasheet/2/281/murata_03052018_GRM_Series_1-1310166.pdf; Component Type: Capacitor 0805; Device Package: 0805; Last Updated: 20.12.2020 17:44:37; Mounting Type: SMD; Operating Temperature: -55 - 85°C; Series: GRM; Supplier 1: Mouser; Supplier Part Number 1: 81-GRM21BR6YA106KE3L; Type: Capacitor; Value: 10 µF; Live Cycle Status: 1; Stock number: Labor SMD Container; LCSC Part Number: C162422
C15 = 10TPE47MAZB: Tantalum Capacitors - Polymer 10volts 47uF ESR 35mohm; Manufacturer: Panasonic; Tolerance: 20 %; Voltage Rating: 10 VDC; Created from: Kilhan; Manufacturer Part Number: 10TPE47MAZB; PartID: 173; Created On: 26/06/2025 16:14:36; ComponentLink1Description: Datasheet; ComponentLink1URL: https://industrial.panasonic.com/cdbs/www-data/pdf/AAA8000/AAA8000C36.pdf; Component Type: Tantalum Capacitor; Device Package: 1210 (3528 metric); Last Updated: 26/06/2025 16:39:07; Mounting Type: SMD; Operating Temperature: -55 to +105°C; Series: TPE; Supplier 1: Mouser; Supplier Part Number 1: 667-10TPE47MAZB; Supplier 2: LCSC; Supplier Part Number 2: C147768; Type: Capacitor; Value: 47 uF; Live Cycle Status: 1; LCSC Part Number: C147768; Stock number: not stored
D2-D4 = KT-0603R: LED RED 520~625NM 90~100MCD@20MA TOP VIEW 0603 ROHS; Manufacturer: Hubei KENTO Elec; Type: Standard; Created from: T. Wendt; Forward Current I_f: 20 mA; Forward Voltage U_f: 2.1 V; Wavelength: 620 nm; Light Intensity: 110 mcd; Nominal Power: 42 mW; Manufacturer Part Number: KT-0603R; PartID: 8; Created On: 03/03/2021 10:06:23; ComponentLink1Description: Datasheet; ComponentLink1URL: https://datasheet.lcsc.com/szlcsc/Hubei-KENTO-Elec-KT-0603R_C2286.pdf; Component Type: LED Diode; Device Package: 0603; Last Updated: 04/03/2021 09:02:49; Mounting Type: SMD; Operating Temperature: -40 - 85 °C; Supplier 1: LCSC; Supplier Part Number 1: C2286; Live Cycle Status: 1; Stock number: not stored; Color: red; LCSC Part Number: C2286
GND PGOOD = NULL: Manufacturer Part Number: NULL; Created from: AGeiger; Created: 2018_06_25_AGeiger; Value: Testpoint 1mm; PartID: 9; Component Type: Testpoint; Manufacturer: NULL; Supplier 1: NULL; Supplier Part Number 1: NULL; Type: Testpoint; Live Cycle Status: 1
  GND: Created On: 20/09/2022 13:14:57; Last Updated: 20/09/2022 13:15:39
  PGOOD: Created On: 20.09.2022 13:14:57; Last Updated: 20.09.2022 13:15:39
L1 L3 L13 = 742792040: Inductance, 0805, 100 MHz, 600 Ohm, 2 A; Manufacturer: Wuerth Elektronik; Type: Inductance SMD; DC current: 2 A; Created from: AGeiger; ComponentLink1Description: Datasheet; ComponentLink1URL: https://www.mouser.de/datasheet/2/445/742792040-1720361.pdf; Value: 600 Ohm; Supplier 1: Mouser; Supplier Part Number 1: 710-742792040; LCSC Part Number: C2661857; Manufacturer Part Number: 742792040; PartID: 1; Created On: 18/01/2021 14:53:17; Component Type: Inductance; Device Package: 0805; Last Updated: 22/08/2024 07:43:45; Mounting Type: SMD; Operating Temperature: -55 - 125 °C; Series: WE-CBF; Live Cycle Status: 1; Stock number: not stored
R1 R6-R10 R17 R18 R38 = 0603WAF1002T5E: SMD resistor 1%; Manufacturer: UNI-ROYAL; Created from: AGeiger; Manufacturer Part Number: 0603WAF1002T5E; PartID: 265; Created On: 01/06/2023 06:49:29; Value: 10k; Device Package: 0603; Tolerance: 1%; Mounting Type: SMD; Last Updated: 01/06/2023 06:49:29; ComponentLink1Description: Datasheet; ComponentLink1URL: https://datasheet.lcsc.com/lcsc/2206010045_UNI-ROYAL-Uniroyal-Elec-0603WAF1002T5E_C25804.pdf; Component Type: SMD resistor; Supplier 1: LCSC; Supplier Part Number 1: C25804; Type: Resistor; Live Cycle Status: 1; LCSC Part Number: C25804
R2 = CRCW0603100KFKEAC: SMD resistor 1%; Manufacturer: Vishay; Created from: MGremer; Manufacturer Part Number: CRCW0603100KFKEAC; PartID: 181; Created On: 14/12/2020 16:17:14; ComponentLink1Description: Datasheet; ComponentLink1URL: https://www.mouser.de/datasheet/2/427/crcwce3-1762584.pdf; Component Type: SMD resistor; Device Package: 0603; Last Updated: 05/08/2026 13:09:54; Mounting Type: SMD; Supplier 1: Mouser; Supplier Part Number 1: 71-CRCW0603100KFKEAC; Type: Resistor; Tolerance: 1%; Value: 100k; Live Cycle Status: 1; Stock number: not stored; LCSC Part Number: C844722
R3 R4 R30-R37 = RC0603JR-070RL: SMD resistor E24 series; Manufacturer: YAGEO; Tolerance: 5%; Created from: MGremer; Manufacturer Part Number: RC0603JR-070RL; PartID: 1; Created On: 14/12/2020 16:17:14; ComponentLink1Description: Datasheet; ComponentLink1URL: https://www.mouser.de/datasheet/2/447/PYu-RC_Group_51_RoHS_L_10-1664068.pdf; Component Type: SMD resistor; Device Package: 0603; Last Updated: 04/03/2021 09:09:42; Mounting Type: SMD; Supplier 1: Mouser; Supplier Part Number 1: 603-RC0603JR-070RL; Supplier 2: LCSC; Supplier Part Number 2: C21189; Type: Resistor; Value: 0R; Live Cycle Status: 1; Stock number: Labor SMD Container; LCSC Part Number: C21189
R5 = 0603WAF5102T5E: 100mW Thick Film Resistors 75V ±100ppm/℃ ±1% 51kΩ 0603 Chip Resistor - Surface Mount ROHS; Manufacturer: UNI-ROYAL(Uniroyal Elec); Created from: KIlhan; Manufacturer Part Number: 0603WAF5102T5E; PartID: 363; Created On: 16/06/2025 17:07:49; ComponentLink1Description: Datasheet; ComponentLink1URL: https://jlcpcb.com/api/file/downloadByFileSystemAccessId/8579706288655699968; Component Type: SMD resistor; Device Package: 0603; Last Updated: 18/06/2025 13:28:44; Mounting Type: SMD; Supplier 1: LCSC; Supplier Part Number 1: C23196; Type: Resistor; Tolerance: 1%; Value: 51k; Live Cycle Status: 1; Stock number: not stored; LCSC Part Number: C23196
U1 = TPSM365R6FRDNR: 3-V to 65-V input, 1-V to 13-V output, 0.6-A synchronous buck converter power module; Manufacturer: Texas Instruments; Created from: KIlhan; Manufacturer Part Number: TPSM365R6FRDNR; PartID: 42; Created On: 16/06/2025 17:12:20; ComponentLink1Description: Datasheet; ComponentLink1URL: https://www.ti.com/lit/ds/symlink/tpsm365r3.pdf?ts=1747982141267; Component Type: Power module with inductor; Device Package: QFN-FCMOD; Last Updated: 16/06/2025 17:12:20; Mounting Type: SMD; Operating Temperature: -40 to +125 °C; Series: TPSM365; Supplier 1: LCSC; Supplier Part Number 1: C6723000; Type: Power module (integrated inductor); Value: TPSM365R6; Live Cycle Status: 1; LCSC Part Number: C6723000; Stock number: not stored; Supplier 2: Mouser; Supplier Part Number 2: 595-TPSM365R6FRDNR
U2 = REF35250QDBVR: 2.5V ±0.05% 2.75V~6V 10mA Fixed SOT-23-6 Voltage Reference ROHS; Manufacturer: Texas Instruments; Created from: KIlhan; Manufacturer Part Number: REF35250QDBVR; PartID: 18; Created On: 20/03/2025 09:42:36; ComponentLink1Description: Datasheet; ComponentLink1URL: https://wmsc.lcsc.com/wmsc/upload/file/pdf/v2/lcsc/2311301509_Texas-Instruments-REF35250QDBVR_C6265005.pdf; Component Type: Voltage Reference; Device Package: SMD; Last Updated: 23/03/2025 21:09:34; Mounting Type: SMD; Operating Temperature: -40℃~+125℃; Supplier 1: Mouser; Supplier Part Number 1: 595-REF35250QDBVR; Supplier 2: LCSC; Supplier Part Number 2: C6265005; Type: Voltage Reference; Value: 2.5V; Live Cycle Status: 1; LCSC Part Number: C6265005; Stock number: not stored
U3 = TPS7A4700RGWR: 1-A, 36-V, low-noise, high-PSRR, low-dropout voltage regulator with enable; Manufacturer_Name: Texas Instruments; Geometry.Height: 1mm; Value: 5 V; Created from: KIlhan; Manufacturer_Part_Number: TPS7A4701RGWR; Mouser Part Number: 595-TPS7A4701RGWR; Mouser Price/Stock: https://www.mouser.co.uk/ProductDetail/Texas-Instruments/TPS7A4701RGWR?qs=2YfbMANv382WBl7zEiZ0Og%3D%3D; Arrow Part Number: TPS7A4701RGWR; Arrow Price/Stock: https://www.arrow.com/en/products/tps7a4701rgwr/texas-instruments?utm_currency=USD&region=nac; Datasheet Link: http://www.ti.com/lit/gpn/tps7a47; Manufacturer Part Number: TPS7A4700RGWR; PartID: 20; Created On: 16/06/2025 23:37:46; ComponentLink1Description: Datasheet; ComponentLink1URL: https://www.ti.com/lit/ds/symlink/tps7a47.pdf?ts=1750053970117&ref_url=https%253A%252F%252Fwww.ti.com%252Fproduct%252FTPS7A47%253FkeyMatch%253DTPS7A4701RGWR%2526tisearch%253Duniversal_search%2526usecase%253DOPN-ALT; Component Type: LDO; Device Package: VQFN-20-EP(5x5); Last Updated: 18/06/2025 15:16:15; Manufacturer: Texas Instruments; Mounting Type: SMD; Operating Temperature: -40 to +125 °C; Series: TPS7A47; Supplier 1: Mouser; Supplier Part Number 1: 595-TPS7A4700RGWR; Supplier 2: LCSC; Supplier Part Number 2: C114839; Type: LDO; Live Cycle Status: 1; LCSC Part Number: C114839; Stock number: not stored

## Sheet Versorgungsspannung.SchDoc
size A4; Author: Tom Gaupp; CompanyName: Technische Hochschule Nürnberg Georg Simon Ohm; Organization: UltraZohm; Address1: Kesslerplatz 12; Address2: 90489 Nürnberg; Address3: GERMANY; SheetNumber: 4; SheetTotal: 4; Website: www.ultrazohm.com
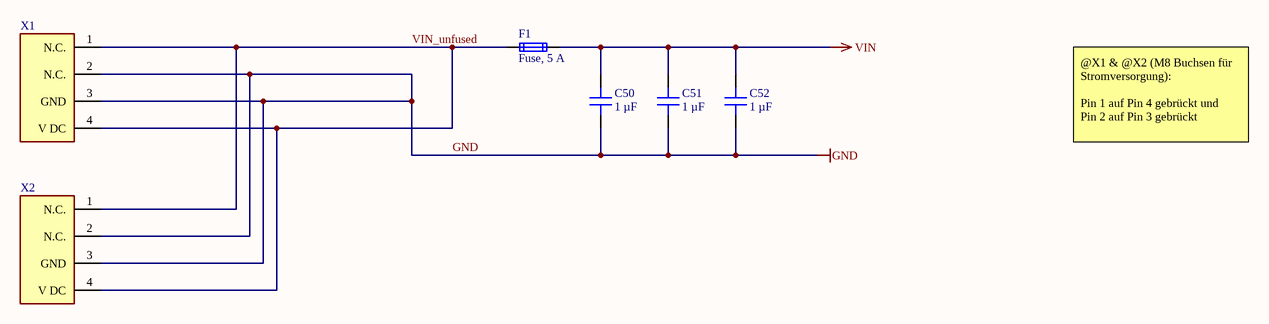
[diagram p3: Versorgungsspannung.SchDoc]

### Parts
C50  1 µF  [C_0603]
C51  1 µF  [C_0603]
C52  1 µF  [C_0603]
F1  Fuse, 5 A  [0154xxx]
X1  CAZN_M12-P4A-GPL_M12  [CAZN_M12-P4A-GPL_M12]  (value not drawn)
X2  CAZN_M12-P4A-GPL_M12  [CAZN_M12-P4A-GPL_M12]  (value not drawn)

### Nets
GND: C50.2 C51.2 C52.2 X1.2(N.C.) X1.3(GND) X2.2(N.C.) X2.3(GND)
VIN: C50.1 C51.1 C52.1 F1.2
VIN_unfused: F1.1 X1.1(N.C.) X1.4(V_DC) X2.1(N.C.) X2.4(V_DC)

### Notes on the sheet
- @X1 & @X2 (M8 Buchsen für Stromversorgung):
  Pin 1 auf Pin 4 gebrückt und
  Pin 2 auf Pin 3 gebrückt
- Title
- Revision:
- Design Engineer:
- Date:
- Project:
- Sheet
- of

### Library data of the parts
C50-C52 = CL10A105KB8NNNC: as C25 on sheet Measurement; Supplier 1: LCSC; Supplier Part Number 1: C15849; Manufacturer Part Number: CL10A105KB8NNNC; Value: 1 µF; PartID: 5; ComponentLink1Description: Datasheet; ComponentLink1URL: https://datasheet.lcsc.com/lcsc/1810261812_Samsung-Electro-Mechanics-CL10A105KB8NNNC_C15849.pdf; Component Type: Capacitor 0603; Device Package: 0603; Mounting Type: SMD; Operating Temperature: -55 - 85°C; Series: M; Type: Capacitor; Tolerance: 10 %; Live Cycle Status: 1; LCSC Part Number: C15849; Stock number: Labor SMD Container
  C50 C51: Created On: 20.12.2020 13:54:13; Last Updated: 28.11.2022 17:23:01
  C52: Created On: 20/12/2020 13:54:13; Last Updated: 28/11/2022 17:23:01
F1 = 0154005.DR: Fuse OMNI BLOK 154; Manufacturer: Littlefuse; Nominal current: 5 A; Nominal voltage AC: 125 VAC; Nominal voltage DC: 125 VDC; Resistance: 12.5 mOhm; Created from: MGremer; Manufacturer Part Number: 0154005.DR; PartID: 1; Created On: 07/01/2021 10:17:19; ComponentLink1Description: Datasheet; ComponentLink1URL: https://www.mouser.de/datasheet/2/240/Littelfuse_Fuse_154_154T_154L_154TL_Datasheet_pdf-365375.pdf; Component Type: NAN02 - 154 OMNI-BLOK; Device Package: OMNI-BLOK; Last Updated: 12/08/2025 20:50:24; Mounting Type: SMD; Operating Temperature: -55 - 125 °C; Series: 154; Supplier 1: Mouser; Supplier Part Number 1: 576-0154005.DR; Supplier 2: LCSC; Supplier Part Number 2: C206916; Type: Fuse; Value: Fuse, 5 A; Live Cycle Status: 1; LCSC Part Number: C206916
X1 X2 = CAZN_M12-P4A-GPL_M12: M12 Metric Circular Connector, A-Coded, Metal Non-shielded, 4A, 04 pins, Male Connector, Male Contact, Hexagonal, M12*1.0, Screw Thread, PCB 90°; Manufacturer: CAZN; Created from: TGaupp; Manufacturer Part Number: CAZN_M12-P4A-GPL_M12; PartID: 31; Created On: 03/06/2026 11:54:12; ComponentLink1Description: Datasheet; ComponentLink1URL: https://www.lcsc.com/datasheet/C19108992.pdf?spm=wm.sxq.inf.ggs___wm.fly.bg.0.xh&lcsc_vid=TwNaAlRSR1ldAVwCFFVbXlUCQQUIVQcDFgRYX1YFEwcxVlNeR1VZUFBQQ1RbXzsOAxUeFF5JWBYZEEoKFBINSQcJGk4eFQsCAgIaSgADAwAHC0slRVNfUVBSTlZADxALGw%3D%3D; Component Type: M12 A-Type 4 Pole Connector; Device Package: THT; Last Updated: 03/06/2026 13:55:49; Mounting Type: THT; Operating Temperature: -25℃ - 80 ℃; Supplier 1: LCSC; Supplier Part Number 1: C19108992; Type: M12 Connector; Live Cycle Status: 1; LCSC Part Number: C19108992; Stock number: not stored

## Nets that join several sheets
2V5_OCM: CurrentMeasuerment_1 (C17A.1 U4A.2), CurrentMeasuerment_2 (C17B.1 U4B.2), Spannungswandlung (5 pins), CurrentMeasuerment_3 (C17C.1 U4C.2), CurrentMeasuerment_4 (C17D.1 U4D.2)
GND: TopSheet (12 pins), CurrentMeasuerment_1 (22 pins), CurrentMeasuerment_2 (22 pins), Spannungswandlung (48 pins), CurrentMeasuerment_3 (22 pins), CurrentMeasuerment_4 (22 pins), Versorgungsspannung (7 pins)
VCC+: CurrentMeasuerment_1 (11 pins), CurrentMeasuerment_2 (11 pins), Spannungswandlung (12 pins), CurrentMeasuerment_3 (11 pins), CurrentMeasuerment_4 (11 pins)
VIN: TopSheet (10 pins), Spannungswandlung (L1.1 R7.1), Versorgungsspannung (C50.1 C51.1 C52.1 F1.2)
I1_OUT_N: TopSheet (J5.A8), CurrentMeasuerment_1 (C16A.2 C18A.1 OUT_NA.1 R13A.2)
I1_OUT_P: TopSheet (J5.A7), CurrentMeasuerment_1 (C18A.2 C20A.1 OUT_PA.1 R15A.2)
I2_OUT_N: TopSheet (J5.A5), CurrentMeasuerment_2 (C16B.2 C18B.1 OUT_NB.1 R13B.2)
I2_OUT_P: TopSheet (J5.A4), CurrentMeasuerment_2 (C18B.2 C20B.1 OUT_PB.1 R15B.2)
I3_OUT_N: TopSheet (J5.A6), CurrentMeasuerment_3 (C16C.2 C18C.1 OUT_NC.1 R13C.2)
I3_OUT_P: TopSheet (J5.A3), CurrentMeasuerment_3 (C18C.2 C20C.1 OUT_PC.1 R15C.2)
I4_OUT_N: TopSheet (J5.A2), CurrentMeasuerment_4 (C16D.2 C18D.1 OUT_ND.1 R13D.2)
I4_OUT_P: TopSheet (J5.A1), CurrentMeasuerment_4 (C18D.2 C20D.1 OUT_PD.1 R15D.2)

## Assembly variants
Default: not fitted J6 J7 R2 R4 R33 R34 R36 R37 R?